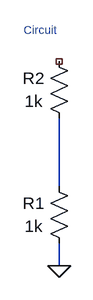
[diagram p0: schematic circuit.asc]
circuit.asc, the LTspice schematic file:
Version 4
SHEET 1 144 432
SYMBOL res 176 464 R180
WINDOW 0 52 72 Center 2
WINDOW 3 52 40 Center 2
SYMATTR InstName R1
SYMATTR Value 1k
SYMBOL res 176 288 R180
WINDOW 0 52 72 Center 2
WINDOW 3 52 40 Center 2
SYMATTR InstName R2
SYMATTR Value 1k
WIRE 160 272 160 368
WIRE 160 448 160 480
FLAG 160 480 0
TEXT 110 148 Left 1 ;Circuit

The netlist it stands for:
* circuit.asc
R1 0 N001 1k
R2 N001 NC_01 1k
* Circuit
.backanno
.end